# EAGLE design TaaraNodeEthernet (EAGLE 6.1)
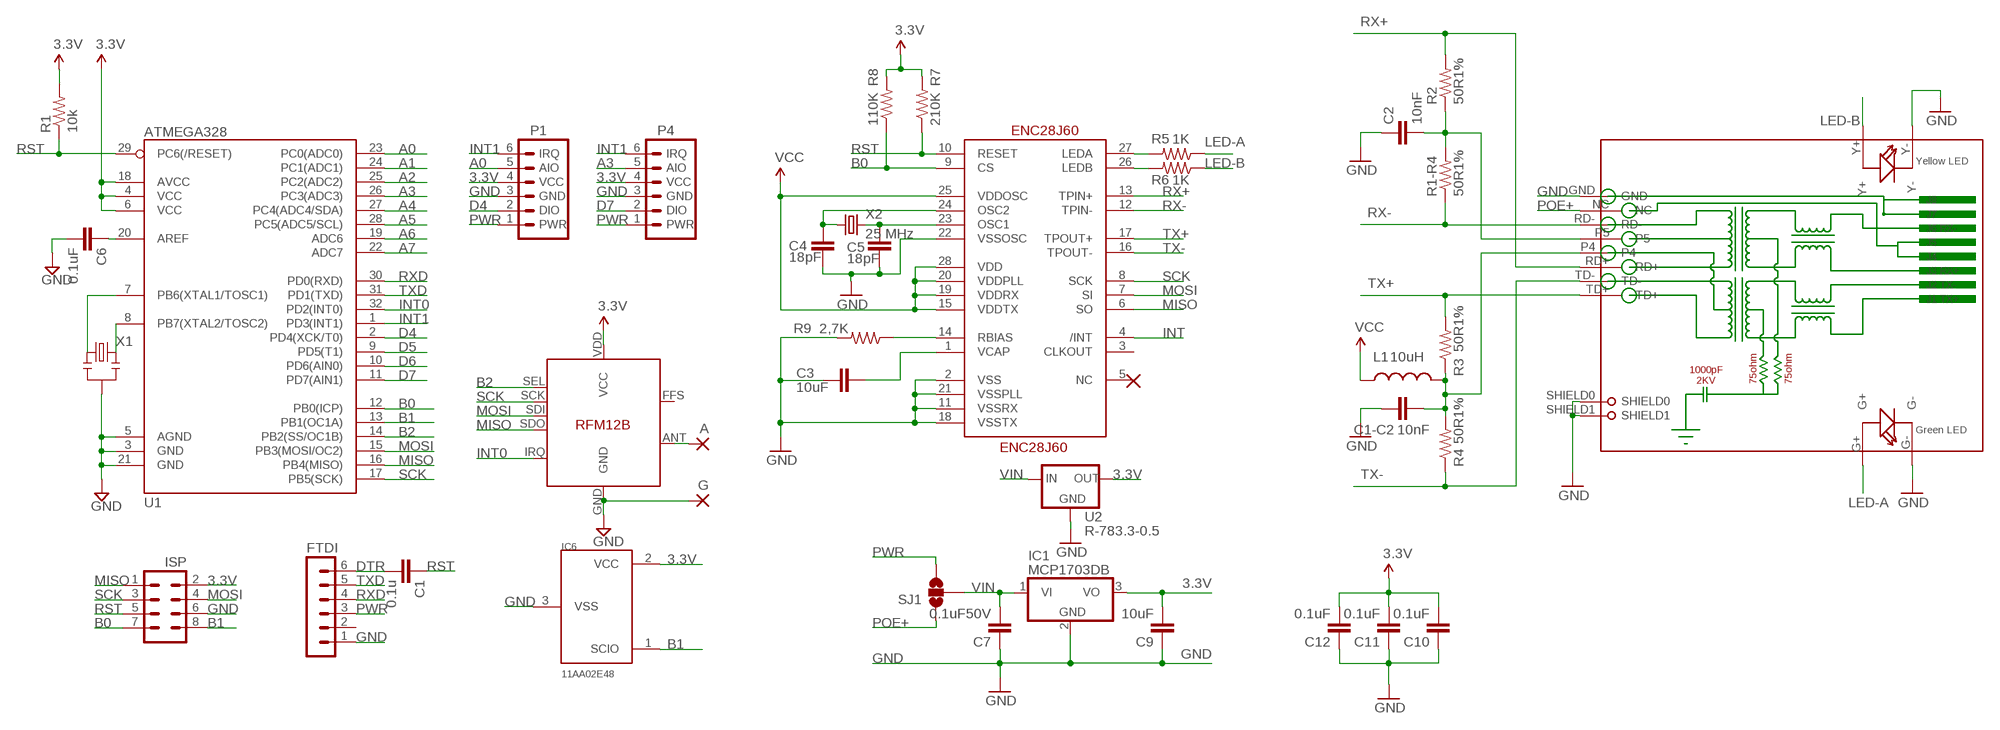
[diagram p0: schematic, sheet 1]

## Parts
A  1,6/0,8  [1,6/0,8]
C1  0.1u  CAP0603-CAP  [0603-CAP]
C1-C2  10nF  CAP0603-CAP  [0603-CAP]
C2  10nF  CAP0603-CAP  [0603-CAP]
C3  10uF  CAP0603-CAP  [0603-CAP]
C4  18pF  CAP0603-CAP  [0603-CAP]
C5  18pF  CAP0603-CAP  [0603-CAP]
C6  0.1uF  CAP0603-CAP  [0603-CAP]
C7  0.1uF50V  CAP0603-CAP  [0603-CAP]
C9  10uF  CAP0603-CAP  [0603-CAP]
C10  0.1uF  CAP0603-CAP  [0603-CAP]
C11  0.1uF  CAP0603-CAP  [0603-CAP]
C12  0.1uF  CAP0603-CAP  [0603-CAP]
ENC28J60  ENC28J60  [SSOP28DB]
FTDI  MA06-1  [MA06-1]
G  1,6/0,8  [1,6/0,8]
IC1  MCP1703DB  [SOT223]
IC6  11AA02E48  [SOT23]
L1  10uH  INDUCTOR0603  [0603]
P1  JEEPORT-FEMALE  [1X06_FEMALE_LOCK.010]
P4  JEEPORT-FEMALE  [1X06_FEMALE_LOCK.010]
R1  10k  RESISTOR0603-RES  [0603-RES]
R1-R4  50R1%  RESISTOR0603-RES  [0603-RES]
R2  50R1%  RESISTOR0603-RES  [0603-RES]
R3  50R1%  RESISTOR0603-RES  [0603-RES]
R4  50R1%  RESISTOR0603-RES  [0603-RES]
R5  1K  RESISTOR0603-RES  [0603-RES]
R6  1K  RESISTOR0603-RES  [0603-RES]
R7  210K  RESISTOR0603-RES  [0603-RES]
R8  110K  RESISTOR0603-RES  [0603-RES]
R9  2,7K  RESISTOR0603-RES  [0603-RES]
RJ1  HLJ-6115ANL  [HR911105A]
SJ1  SOLDERJUMPER_2WAYT  [SJ_2]
SV7  ISP  MA04-2  [MA04-2]
U1  ATMEGA328  ATMEGA168  [TQFP32-08]
U2  R-783.3-0.5  R-78XX  [R-78XX]
U$1  RFM12B  [RFM12B]
X1  RESONATORSMD  [RESONATOR-SMD]
X2  25 MHz  CRYSTAL3.2X2.5  [CRYSTAL-SMD-3.2X2.5]

## Nets
3.3V [power]: C9.2 C10.2 C11.2 C12.2 ENC28J60.15(VDDTX) ENC28J60.19(VDDRX) ENC28J60.20(VDDPLL) ENC28J60.25(VDDOSC) ENC28J60.28(VDD) IC1.3(VO) IC6.2(VCC) L1.1 P1.4(VCC) P4.4(VCC) R1.2 R7.2 R8.2 SV7.2 U1.4(VCC) U1.6(VCC) U1.18(AVCC) U2.OUT U$1.VDD(VCC) ; supply symbol labelled VCC
A0: P1.5(AIO) U1.23(PC0(ADC0))
A1: U1.24(PC1(ADC1))
A2: U1.25(PC2(ADC2))
A3: P4.5(AIO) U1.26(PC3(ADC3))
A4: U1.27(PC4(ADC4/SDA))
A5: U1.28(PC5(ADC5/SCL))
A6: U1.19(ADC6)
A7: U1.22(ADC7)
B0: ENC28J60.9(CS) R8.1 SV7.7 U1.12(PB0(ICP))
B1: IC6.1(SCIO) SV7.8 U1.13(PB1(OC1A))
B2: U1.14(PB2(SS/OC1B)) U$1.SEL
D4: P1.2(DIO) U1.2(PD4(XCK/T0))
D5: U1.9(PD5(T1))
D6: U1.10(PD6(AIN0))
D7: P4.2(DIO) U1.11(PD7(AIN1))
DTR: C1.2 FTDI.6
GND [power]: C1-C2.1 C2.1 C3.1 C4.1 C5.1 C6.2 C7.1 C9.1 C10.1 C11.1 C12.1 ENC28J60.2(VSS) ENC28J60.11(VSSRX) ENC28J60.18(VSSTX) ENC28J60.21(VSSPLL) ENC28J60.22(VSSOSC) FTDI.1 G.1(P) IC1.2(GND) IC6.3(VSS) P1.3(GND) P4.3(GND) R9.2 RJ1.G- RJ1.GND RJ1.SHIELD0 RJ1.SHIELD1 RJ1.Y- SV7.6 U1.3(GND) U1.5(AGND) U1.21(GND) U2.GND U$1.GND X1.2
INT: ENC28J60.4(/INT)
INT0: U1.32(PD2(INT0)) U$1.IRQ
INT1: P1.6(IRQ) P4.6(IRQ) U1.1(PD3(INT1))
LED-A: R5.1 RJ1.G+
LED-B: R6.1 RJ1.Y+
MISO: ENC28J60.6(SO) SV7.1 U1.16(PB4(MISO)) U$1.SDO
MOSI: ENC28J60.7(SI) SV7.4 U1.15(PB3(MOSI/OC2)) U$1.SDI
N$1: U1.7(PB6(XTAL1/TOSC1)) X1.1
N$2: C6.1 U1.20(AREF)
N$9: ENC28J60.27(LEDA) R5.2
N$10: ENC28J60.26(LEDB) R6.2
N$12: ENC28J60.14(RBIAS) R9.1
N$13: C3.2 ENC28J60.1(VCAP)
N$15: C4.2 ENC28J60.24(OSC2) X2.1
N$16: C5.2 ENC28J60.23(OSC1) X2.3
N$18: A.1(P) U$1.ANT
N$21: U1.8(PB7(XTAL2/TOSC2)) X1.3
POE+ [power]: RJ1.NC SJ1.1
PWR [power]: FTDI.3 P1.1(PWR) P4.1(PWR) SJ1.3
RCT: C2.2 R1-R4.2 R2.1 RJ1.P5
RST: C1.1 ENC28J60.10(RESET) R1.1 R7.1 SV7.5 U1.29(PC6(/RESET))
RX+: ENC28J60.13(TPIN+) R2.2 RJ1.RD+
RX-: ENC28J60.12(TPIN-) R1-R4.1 RJ1.RD-
RXD: FTDI.4 U1.30(PD0(RXD))
SCK: ENC28J60.8(SCK) SV7.3 U1.17(PB5(SCK)) U$1.SCK
TCT: C1-C2.2 L1.2 R3.1 R4.2 RJ1.P4
TX+: ENC28J60.17(TPOUT+) R3.2 RJ1.TD+
TX-: ENC28J60.16(TPOUT-) R4.1 RJ1.TD-
TXD: FTDI.5 U1.31(PD1(TXD))
VIN [power]: C7.2 IC1.1(VI) SJ1.2 U2.IN
Unconnected: ENC28J60.3(CLKOUT) ENC28J60.5(NC) FTDI.2 U$1.FFS

## Library data of the parts
A G = wirepad:1,6/0,8: THROUGH-HOLE PAD
C1 C1-C2 C2-C7 C9-C12 = SparkFun:CAP: Capacitor Standard 0603 ceramic capacitor, and 0.1" leaded capacitor.
ENC28J60 = SparkFun:ENC28J60
FTDI = JeeLabs:MA06-1: PIN HEADER
IC1 = linear:MCP1703: 250 mA, 16V, Low Quiescent Current LDO Regulator Source: http://ww1.microchip.com/downloads/en/DeviceDoc/22049b.pdf
IC6 = nanode:11AA02E48
L1 = SparkFun:INDUCTOR: Inductors Basic Inductor/Choke - 0603 and 1206. Footprints are not proven and vary greatly between part numbers.
P1 P4 = JeeLabs:JEEPORT: PIN HEADER
R1 R1-R4 R2-R9 = SparkFun:RESISTOR: Resistor Basic schematic elements and footprints for 0603, 1206, and PTH resistors.
RJ1 = Itead_BP_110825:HLJ-6115ANL: SOC015
SJ1 = SparkFun:SOLDERJUMPER_2WAY: Solder Jumper 2 way solder jumper
SV7 = JeeLabs:MA04-2: PIN HEADER
U1 = SparkFun:ATMEGA168
U2 = omc:R-78XX: Recom R78xx - Switching Regulator - pin-out compatible with LM78xx - up to 97% efficiency - input range 4.75V to 18V for 1A or 34V for 0.5A version, resp. - L * W * H = 11.5mm * 7.5mm * 10.2mm - low ripple and noise (less than 30mVpp) - short circuit protection, thermal shutdown
U$1 = JeeLabs:RFM12B
X1 = SparkFun:RESONATOR: Resonator Small SMD resonator. This is the itty bitty 10/20MHz resonators with built in caps. CSTCE10M0G55 and CSTCE20M0V53. Footprint has been reviewed closely but hasn't been tested yet.
X2 = JeeLabs:CRYSTAL: Crystals Various standard crystals. Proven footprints. Spark Fun Electronics SKU : COM-00534

## Net classes
0 default: width 0.203 mm, clearance 0.203 mm
1 power: width 0.381 mm, clearance 0.254 mm

## Board
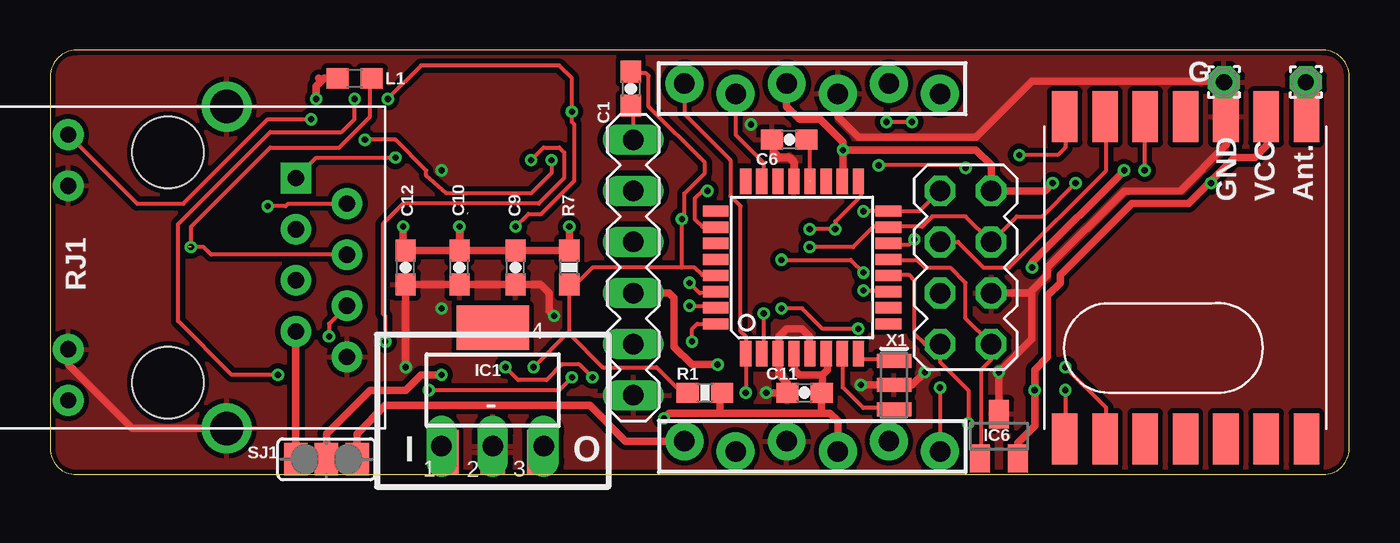
[diagram p1: board, top side]
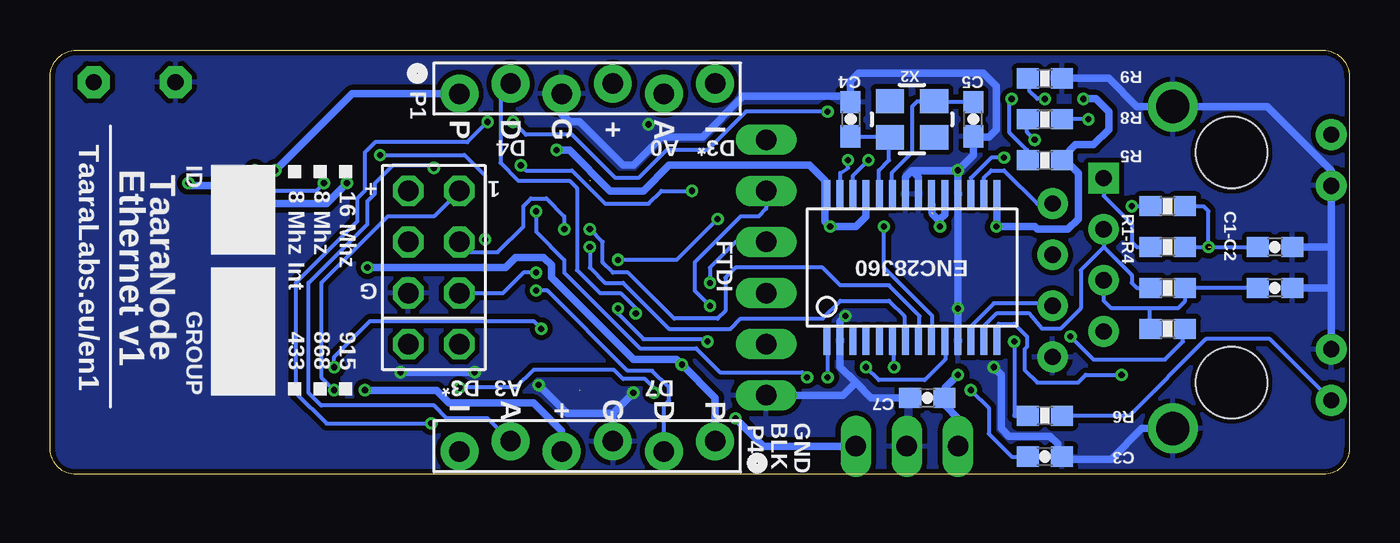
[diagram p2: board, bottom side, seen from below]

Size 64.52 x 21.08 mm. Coordinates in mm from the lower left corner, seen from the top.
Outline: 63.25,0 arc90 64.52,1.27 64.52,19.81 arc90 63.25,21.08 1.27,21.08 arc90 0,19.81 0,1.27 arc90 1.27,0 63.25,0
Copper layers (1*16): Top 0.035mm / dielectric 1.5mm / Bottom 0.035mm
Design rules: minimum track width 6mil, minimum drill 12mil, track to track 6mil, track to pad 6mil, pad to pad 6mil, via to via 6mil, smd to smd 0mil, copper to edge 10mil, drill to drill 10mil, minimum pad ring 10mil, minimum via ring 6mil, stop-mask expansion 2mil, vias tented up to drill 100mil, thermal gap 10mil

### Footprints (pad centres in the part's own frame; a part is rotated, then mirrored left to right if it is on the bottom)
1,6/0,8 = drill 0.813 pad 1.6 octagon: 1 0,0
0603-CAP = smd 1.1 x 1: 1 -0.85,0; 2 0.85,0
SSOP28DB = smd 0.348 x 1.397: 1 -4.225,-3.656; 2 -3.575,-3.656; 3 -2.925,-3.656; 4 -2.275,-3.656; 5 -1.625,-3.656; 6 -0.975,-3.656; 7 -0.325,-3.656; 8 0.325,-3.656; 9 0.975,-3.656; 10 1.625,-3.656; 11 2.275,-3.656; 12 2.925,-3.656; 13 3.575,-3.656; 14 4.225,-3.656; 15 4.225,3.656; 16 3.575,3.656; 17 2.925,3.656; 18 2.275,3.656; 19 1.625,3.656; 20 0.975,3.656; 21 0.325,3.656; 22 -0.325,3.656; 23 -0.975,3.656; 24 -1.625,3.656; 25 -2.275,3.656; 26 -2.925,3.656; 27 -3.575,3.656; 28 -4.225,3.656
MA06-1 = drill 1.016 long: 1 0,0; 2 2.54,0; 3 5.08,0; 4 7.62,0; 5 10.16,0; 6 12.7,0
SOT223 = smd 1.219 x 2.235: 1 -2.311,-3.099; 2 0,-3.099; 3 2.311,-3.099 | smd 3.6 x 2.2: 4 0,3.099
SOT23 = smd 1 x 1.4: 1 -0.95,-1.1; 2 0.95,-1.1; 3 0,1.1
0603 = smd 1.1 x 1: 1 -0.85,0; 2 0.85,0
1X06_FEMALE_LOCK.010 = drill 1.016 pad 1.88: 1 0,0.254; 2 2.54,-0.254; 3 5.08,0.254; 4 7.62,-0.254; 5 10.16,0.254; 6 12.7,-0.254
0603-RES = smd 1.1 x 1: 1 -0.85,0; 2 0.85,0
HR911105A = drill 0.813 pad 1.524: G+ 4.953,-6.604; G- 4.953,-4.064; GND -8.89,4.445; NC -6.35,3.175; P4 -8.89,-0.635; P5 -6.35,0.635; RD+ -6.35,-1.905; RD- -8.89,1.905; TD- -8.89,-3.175; Y+ 4.953,6.604; Y- 4.953,4.064 | drill 1.651 pad 2.159: SHIELD0 -2.921,8.001; SHIELD1 -2.921,-8.001 | drill 0.813 pad 1.524 square: TD+ -6.35,-4.445 | hole 3.556: 0,-5.715; 0,5.715
SJ_2 = smd 1.168 x 1.6: 1 -1.524,0; 2 0,0; 3 1.524,0
MA04-2 = drill 1.016 octagon: 1 -3.81,-1.27; 2 -3.81,1.27; 3 -1.27,-1.27; 4 -1.27,1.27; 5 1.27,-1.27; 6 1.27,1.27; 7 3.81,-1.27; 8 3.81,1.27
TQFP32-08 = smd 1.27 x 0.559: 1 -4.293,2.8; 2 -4.293,2; 3 -4.293,1.2; 4 -4.293,0.4; 5 -4.293,-0.4; 6 -4.293,-1.2; 7 -4.293,-2; 8 -4.293,-2.8; 17 4.293,-2.8; 18 4.293,-2; 19 4.293,-1.2; 20 4.293,-0.4; 21 4.293,0.4; 22 4.293,1.2; 23 4.293,2; 24 4.293,2.8 | smd 0.559 x 1.27: 9 -2.8,-4.293; 10 -2,-4.293; 11 -1.2,-4.293; 12 -0.4,-4.293; 13 0.4,-4.293; 14 1.2,-4.293; 15 2,-4.293; 16 2.8,-4.293; 25 2.8,4.293; 26 2,4.293; 27 1.2,4.293; 28 0.4,4.293; 29 -0.4,4.293; 30 -1.2,4.293; 31 -2,4.293; 32 -2.8,4.293
R-78XX = drill 1.016 long: GND 0,-1.775; IN -2.54,-1.775; OUT 2.54,-1.775
RFM12B = smd 2.54 x 1.27: ANT 8,-6; FFS -8,2; GND 8,-2; IRQ -8,4; P$8 -8,0; P$9 -8,-2; P$10 -8,-4; P$12 -8,-6; P$16 8,0; SCK 8,4; SDI 8,2; SDO -8,6; SEL 8,6; VDD 8,-4
RESONATOR-SMD = smd 0.7 x 1.7: 1 -1.2,0; 2 0,0; 3 1.2,0
CRYSTAL-SMD-3.2X2.5 = smd 1.4 x 1.2: 1 -1.1,-0.9; 2 1.1,-0.9; 3 1.1,0.9; 4 -1.1,0.9

### Placement (x,y rotation side)
A  62.36,19.5 0 top
C1  28.83,19.18 270 top
C1-C2  3.68,11.3 180 bottom
C2  3.68,9.27 180 bottom
C3  15.11,0.89 180 bottom
C4  24.77,17.65 270 bottom
C5  18.67,17.65 90 bottom
C6  36.7,16.64 180 top
C7  20.96,3.81 0 bottom
C9  23.11,10.29 90 top
C10  20.32,10.29 90 top
C11  37.47,4.06 0 top
C12  17.65,10.29 90 top
ENC28J60  21.72,10.29 0 bottom
FTDI  28.96,3.94 90 top
G  58.3,19.5 0 top
IC1  21.97,4.19 0 top
IC6  47.12,1.91 0 top
L1  15.11,19.68 0 top
P1  44.2,19.18 180 top
P4  31.5,1.4 0 top
R1  32.51,4.06 0 top
R1-R4  9.02,7.24 180 bottom
R2  9.02,9.27 180 bottom
R3  9.02,11.3 180 bottom
R4  9.02,13.33 0 bottom
R5  15.11,17.65 180 bottom
R6  15.11,2.92 180 bottom
R7  25.78,10.29 90 top
R8  15.11,15.62 0 bottom
R9  15.11,19.68 0 bottom
RJ1  5.84,10.29 180 top
SJ1  13.72,0.76 0 top
SV7  45.47,10.29 270 top
U1  37.34,10.29 90 top
U2  21.97,3.17 0 top
U$1  56.39,9.78 90 top
U$2  [NODEPARAMS]  48.9,10.29 0 top
X1  41.91,4.45 90 top
X2  21.72,17.65 0 bottom

### Tracks (layer width: path | path; a pad name or v marks a point on that pad's centre or on a via)
3.3V  (via drill 0.3)  (2 unrouted)
  Top 0.381: 25.78,10.79 R7.2 | v17.53,12.32 17.53,10.79 C12.2 C10.2 | U1.18 39.37,14.6 v39.37,16.13 | v39.37,16.13 45.97,16.13 46.74,15.37 SV7.2 49.4,14.1 v49.78,14.48 | U1.4 36.96,5.84 36.96,5.21 37.21,4.95 38.35,4.95 | U1.6 38.61,5.84 38.61,5.21 38.35,4.95 | 33.27,4.06 R1.2 33.27,4.06 | 57.59,14.54 56.52,13.46 53.72,13.46 50.17,9.91 50.17,9.52 49.53,8.89 49.53,5.84 48.9,5.21 v48.9,4.19 48.9,2.41 48.07,1.59 IC6.2 48.13,0.74 | 57.59,14.54 58.8,15.75 59.82,15.75 60.45,16.38 60.45,17.65 U$1.VDD | v30.48,2.79 30.73,3.05 33.27,3.05 | 33.27,4.06 33.27,3.05 | 33.02,4.06 33.27,4.06 | v57.66,14.48 57.59,14.54 | L1.1 13.59,19.68 13.46,19.56 | 13.46,19.56 13.21,19.3 v13.21,18.67 | P4.4 39.12,2.67 38.73,3.05 38.31,3.05 | 38.31,3.05 33.27,3.05 | IC1.3 24.52,1.06 | R7.2 C9.2 20.47,11.14 | P1.4 36.58,18.29 37.21,17.65 38.23,17.65 39.37,16.51 v39.37,16.13 | 13.34,19.68 13.46,19.56 | 38.2,4.18 C11.2 38.31,3.05 | R7.2 v25.78,12.32 | 38.35,4.95 38.35,4.32 38.23,4.19
  Top 0.406: U2.OUT 24.51,1.32 IC1.3 | v20.32,12.32 20.32,11.16 | 20.32,11.16 C10.2 | 20.32,11.16 20.47,11.14
  Bottom 0.381: v13.21,18.67 12.57,18.67 11.94,18.03 11.94,17.14 12.7,16.38 13.59,16.38 14.22,15.75 | 14.22,15.75 R8.2 | ENC28J60.25 24,13.72 24,12.83 24.51,12.32 v25.78,12.32 26.04,12.57 26.04,13.72 | 26.04,13.72 ENC28J60.28 | 14.22,15.75 13.46,14.99 13.46,12.7 13.97,12.19 15.49,12.19 15.62,12.32 v17.53,12.32 17.49,12.48 ENC28J60.15 | v48.9,4.19 45.34,4.19 44.7,3.56 40.52,3.56 39.12,2.16 P4.4 | v49.78,14.48 50.8,13.46 53.59,13.46 54.48,14.35 57.53,14.35 v57.66,14.48 | 26.04,13.72 26.04,14.6 26.8,15.37 33.78,15.37 35.05,14.1 36.7,14.1 38.73,16.13 v39.37,16.13 | ENC28J60.20 20.71,13.02 | ENC28J60.19 20.09,13.01 20.09,12.93 20.32,12.7 | U2.OUT 29.09,1.4 v30.48,2.79 | 20.32,12.7 20.45,12.7 20.7,12.95 | v20.32,12.32 20.32,12.7
A0
  Top 0.203: U1.23 35.43,14.6 35.43,15.49 34.04,16.89 P1.5
A2
  Top 0.203: U1.25 33.27,13.08 33.3,13.11
A3  (via drill 0.3)
  Top 0.203: v32.64,14.1 32.39,14.1 32,13.72 32,12.7 32.39,12.32 33.02,12.32 U1.26 | v41.15,15.37 45.34,15.37 v45.47,15.24
  Bottom 0.203: v32.64,14.1 34.16,14.1 34.8,13.46 36.96,13.46 38.61,15.11 40.89,15.11 v41.15,15.37 | v45.47,15.24 45.59,15.37 47.5,15.37 48.39,14.48 48.39,13.97 48.77,13.59 48.77,12.45 51.69,9.52 51.69,4.06 51.05,3.43 45.47,3.43 44.83,2.79 42.8,2.79 P4.5
B0  (via drill 0.3)
  Top 0.203: U1.12 41.78,9.91 42.67,9.91 42.93,9.65 42.93,6.99 43.43,6.48 SV7.7 44.2,5.59 45.59,4.19 v45.59,2.54 | v16.76,18.67 18.42,20.32 25.27,20.32 25.91,19.68 v25.91,18.03 25.91,17.53 26.04,17.4 26.04,14.6 24.38,12.95 23.75,12.95 v23.11,12.32 | v41.53,17.53 v42.8,17.53
  Bottom 0.203: v16.76,18.67 16.89,18.54 16.89,17.02 16,16.13 16,15.75 R8.1 | v23.11,12.32 23.11,10.29 20.7,7.87 20.7,6.48 ENC28J60.9 | v45.59,2.54 50.8,2.54 52.32,4.06 52.32,9.52 49.28,12.57 49.28,13.72 48.9,14.1 48.9,16 48.39,16.51 43.81,16.51 v42.8,17.53 | v41.53,17.53 40.89,16.89 38.61,16.89 36.45,14.73 35.31,14.73 33.91,16.13 31.88,16.13 29.97,18.03 v25.91,18.03
B1
  Top 0.203: 41.66,10.67 U1.13 41.78,10.67 43.05,10.67 43.43,10.29 44.7,10.29 45.47,9.52 45.47,7.75 SV7.8 46.74,5.71 46.23,5.21 46.23,1.4 IC6.1
B2  (via drill 0.3)
  Top 0.203: v48.13,15.88 50.04,15.88 50.42,16.26 50.42,17.65 U$1.SEL | U1.14 41.78,11.43 42.67,11.43 v42.93,11.68
  Bottom 0.203: v42.93,11.68 42.93,14.86 43.94,15.88 v48.13,15.88
D4  (via drill 0.3)
  Top 0.203: v35.43,8 35.43,5.97 U1.2
  Bottom 0.203: v35.43,8 35.43,8.25 36.2,9.02 37.21,9.02 38.35,10.16 38.35,14.22 38.73,14.6 41.28,14.6 42.16,15.49 42.16,18.92 P1.2
D7  (via drill 0.3)
  Top 0.203: U1.11 41.66,9.02 41.53,9.14 v40.39,9.14
  Bottom 0.203: v40.39,9.14 39.83,9.14 35.84,5.16 34.62,5.16 33.78,4.32 33.78,3.68 34.04,3.43 P4.2
DTR
  Top 0.203: FTDI.6 28.96,18.16 28.83,18.29 C1.2
GND  (via drill 0.3)
  Top 0.381: U1.5 37.72,5.97 37.72,6.86 37.34,7.24 36.58,7.24 36.2,6.86 36.2,6.22 U1.3 36.2,5.94 36.2,4.95 36.61,4.53 C11.1 v35.56,4.06 | v40.26,4.45 X1.2 42.8,4.45 v43.43,5.08 | 48.77,9.02 48.77,6.73 v47.12,5.08 47.12,3.05 | 48.77,9.02 48.77,9.14 49.53,9.91 49.53,10.29 53.34,14.1 56.13,14.1 58.42,16.38 58.42,17.65 U$1.GND 58.42,17.78 58.29,17.78 G.1 58.29,19.56 48.77,19.56 45.97,16.76 40.13,16.76 39.12,17.78 P1.3 | RJ1.SHIELD0 4.06,2.29 0.89,5.46 RJ1.Y- | 36.96,14.6 U1.21 | C12.1 17.65,9.4 | 17.65,9.4 v17.65,5.33 | v25.02,7.87 24.77,8.13 24.77,9.02 24.35,9.44 C9.1 | IC1.2 22.08,1.13 | 17.65,9.4 17.69,9.44 C10.1 23.24,9.44 | SV7.6 48.77,9.02
  Top 0.406: 23.24,9.44 23.24,9.4 | 36.96,14.6 36.96,15.49 36.7,15.75 36.2,15.75 35.94,16 35.94,16.64
  Bottom 0.381: v40.26,4.45 38.86,3.05 36.58,3.05 | v47.12,5.08 v43.43,5.08 | R9.2 11.94,19.68 10.54,18.29 RJ1.SHIELD1 4.06,18.29 0.89,15.11 RJ1.G- 0.89,11.3 | 0.89,11.3 C1-C2.1 | 0.89,9.27 0.89,11.3 | C2.1 0.89,9.27 | RJ1.Y- 0.89,9.27 | v19.43,8.25 19.43,7.49 | 24.51,4.57 23.75,3.81 C7.1 | 24.51,4.57 25.29,5.35 ENC28J60.2 25.29,7.6 v25.02,7.87 | 18.67,16.76 18.67,15.88 v19.43,15.11 | 18.67,16.76 C5.1 18.67,16.89 | v19.43,15.11 19.43,13.84 ENC28J60.18 19.43,13.59 v19.43,8.25 | C4.1 24.77,19.56 24.38,19.94 18.16,19.94 17.53,19.3 17.53,17.14 17.91,16.76 18.67,16.76 | 24.77,18.41 C4.1 | v19.43,15.11 21.72,15.11 | C4.1 25.02,18.8 30.1,18.8 32.13,16.76 34.16,16.76 35.56,15.37 36.07,15.37 38.23,17.53 38.73,17.53 39.12,17.91 P1.3 | v17.65,5.33 17.27,4.95 17.27,2.29 16.89,1.91 14.86,1.91 14.48,1.52 14.48,0.76 C3.1 14.22,0.76 11.81,0.76 10.29,2.29 RJ1.SHIELD0 | ENC28J60.22 22.04,14.79 21.72,15.11 | ENC28J60.21 21.39,14.79 21.72,15.11 | ENC28J60.11 19.44,7.61 v19.43,8.25 | FTDI.1 25.15,3.94 24.51,4.57 | v35.56,4.06 36.58,3.05 | 36.58,3.05 P4.3
  other vias: 34.8,17.4
  pour Bottom: 1.27,0 63.25,0 arc90 64.52,1.27 64.52,19.81 arc90 63.25,21.08 1.27,21.08 arc90 0,19.81 0,1.27 arc90
  pour Top: 1.27,0 63.25,0 arc90 64.52,1.27 64.52,19.81 arc90 63.25,21.08 1.27,21.08 arc90 0,19.81 0,1.27 arc90
INT0  (via drill 0.3)
  Top 0.203: v31.88,6.6 31.88,7.24 32.13,7.49 33.02,7.49 U1.32 | v36.32,8.25 37.34,8.25 38.35,7.24 v40.13,7.24 | v50.42,5.33 52.45,3.3 52.45,1.78 U$1.IRQ
  Bottom 0.203: v31.88,6.6 32,6.73 35.05,6.73 36.32,8 v36.32,8.25 | v40.13,7.24 40.51,7.62 48.64,7.62 50.42,5.84 v50.42,5.33
INT1  (via drill 0.3)
  Top 0.203: v44.2,4.32 P4.6 | 34.54,5.97 v34.54,4.06 | 34.54,5.97 U1.1 | P1.6 31.5,17.91 33.78,15.62 33.78,13.84 34.29,13.33 34.29,7.11 34.54,6.86 34.54,5.97
  Bottom 0.203: v44.2,4.32 41.4,4.32 40.51,5.21 36.53,5.21 36.07,4.75 34.98,4.75 34.54,4.32 v34.54,4.06
LED-A  (via drill 0.3)
  Top 0.203: v12.95,17.65 10.8,17.65 6.6,13.46 4.32,13.46 RJ1.G+
  Bottom 0.203: v12.95,17.65 R5.1
LED-B
  Bottom 0.203: RJ1.Y+ 3.94,6.73 7.11,6.73 10.92,2.92 R6.1 14.35,2.92
MISO  (via drill 0.3)
  Top 0.203: v22.61,5.33 23.24,4.7 24.64,4.7 25.4,5.46 26.29,5.46 v26.92,4.83 | v40.39,13.08 41.66,13.08 U1.16 41.78,13.08 43.18,13.08 SV7.1 | v50.42,4.19 50.42,1.78 U$1.SDO
  Bottom 0.203: v26.92,4.83 27.18,5.08 31.24,5.08 32.44,6.27 35.23,6.27 38.99,10.03 38.99,10.67 40.39,12.06 v40.39,13.08 | ENC28J60.6 22.61,6.35 v22.61,5.33 | v50.42,4.19 51.05,4.83 51.05,9.52 47.75,12.83 45.47,12.83 SV7.1
MOSI  (via drill 0.3)
  Top 0.203: v37.72,11.3 39.88,11.3 40.89,12.32 41.66,12.32 U1.15 41.78,12.32 43.31,12.32 43.81,12.83 45.47,12.83 SV7.4 48.01,12.83 49.28,12.83 v50.93,14.48 | v54.36,15.11 54.36,17.65 U$1.SDI
  Bottom 0.203: v37.72,11.3 37.72,10.29 36.96,9.52 36.07,9.52 33.78,7.24 30.73,7.24 30.23,7.75 26.16,7.75 25.27,8.64 22.86,8.64 22.1,7.87 22.1,6.48 ENC28J60.7 | v54.36,15.11 53.34,14.1 51.31,14.1 v50.93,14.48
N$1
  Top 0.203: U1.7 39.37,5.84 39.37,4.32 40.39,3.3 41.91,3.3 X1.1
N$2  (1 unrouted)
  Top 0.203: C6.1 37.72,16.47 37.72,14.6
N$9  (via drill 0.3)
  Top 0.203: v15.62,16.64 17.14,16.64 18.67,15.11 18.67,14.86 19.68,13.97 23.88,13.97 24.89,14.99 v24.89,15.62
  Bottom 0.203: v15.62,16.64 16,17.02 16,17.65 R5.2 | v24.89,15.62 24.89,15.24 25.27,14.99 25.27,13.84 ENC28J60.27
N$10  (via drill 0.3)
  Top 0.203: v16.64,6.6 16.64,7.87 16.51,8 16.51,12.45 17.53,13.46 24.26,13.46 25.53,14.73 25.53,16 25.27,16.26 24.51,16.26 v23.88,15.62
  Bottom 0.203: R6.2 16.64,2.92 v16.64,6.6 | v23.88,15.62 24.64,14.86 24.64,13.84 ENC28J60.26
N$12  (via drill 0.3)
  Top 0.203: v15.11,18.67 15.11,17.65 14.48,17.02 10.92,17.02 6.35,12.45 6.35,7.62 9.02,4.95 v11.3,4.95
  Bottom 0.203: v15.11,18.67 15.49,18.67 15.88,19.05 15.88,19.68 R9.1 | v11.3,4.95 13.08,4.95 13.46,4.57 15.49,4.57 16.13,5.21 16.13,6.22 16,6.35 16,6.86 16.64,7.49 17.4,7.49 17.53,7.37 17.53,6.48 ENC28J60.14
N$13  (via drill 0.3)
  Top 0.203: v18.8,4.19 25.27,4.19 v25.91,4.83
  Bottom 0.203: C3.2 16.76,0.89 17.91,2.03 17.91,3.3 v18.8,4.19 | ENC28J60.1 25.91,6.35 v25.91,4.83
N$15
  Bottom 0.203: 22.99,16.64 X2.1 | ENC28J60.24 23.37,13.84 23.37,15.11 22.86,15.62 22.86,16.76 22.9,16.8 | 22.86,16.71 X2.1 | C4.2 22.9,16.8 | 22.9,16.8 22.87,16.8 X2.1
N$16
  Bottom 0.203: C5.2 18.67,18.54 20.45,18.54 X2.3 20.7,18.54 21.46,18.54 21.72,18.29 21.72,16 22.73,14.99 22.73,13.97 ENC28J60.23
N$18
  Top 0.203: U$1.ANT 62.36,17.78 62.36,19.43 A.1
N$21
  Top 0.203: U1.8 40.26,5.84 40.39,5.71 41.91,5.71 X1.3
POE+
  Top 0.381: RJ1.NC SJ1.1
PWR  (via drill 0.3)
  Top 0.381: 13.72,0.76 SJ1.3 15.24,2.03 16.64,3.43 26.8,3.43 28.57,1.65 P4.1 | v53.34,15.11 48.77,10.54 v48.77,10.29 | v33.15,5.46 31.88,5.46 30.99,6.35 30.99,8.76 30.73,9.02 FTDI.3
  Bottom 0.381: v53.34,15.11 49.53,18.92 P1.1 | v48.77,10.29 41.91,10.29 41.4,10.79 40,10.79 39.62,10.41 39.62,9.78 35.56,5.71 33.4,5.71 v33.15,5.46 31.5,3.81 P4.1
RCT
  Bottom 0.203: C2.2 R2.1 8.17,8.6 8.51,8.25 9.91,8.25 | 9.78,7.37 R1-R4.2 9.91,7.37 9.91,8.25 | 9.91,8.25 11.81,8.25 12.19,8.64 RJ1.P5
RST  (via drill 0.3)
  Top 0.203: R7.1 25.78,7.11 25.72,7.05 | v24,5.33 25.72,7.05 | 25.72,7.05 27.43,5.33 30.1,5.33 31.37,4.06 31.5,4.06 R1.1 | 33.15,9.91 U1.29 33.02,9.91 32.39,9.91 32,10.29 31.37,10.29 | v40.39,10.03 39.75,10.67 v36.32,10.67 | 31.37,10.29 26.92,10.29 26.16,9.52 25.78,9.52 R7.1 | 25.91,9.14 R7.1 | C1.1 28.92,19.94 29.59,19.94 29.72,19.81 29.72,18.29 32.51,15.49 32.51,14.99 31.5,13.97 31.5,12.83 v31.37,12.7 31.37,10.29
  Bottom 0.203: v24,5.33 23.37,4.7 21.08,4.7 20.07,5.71 20.07,6.35 ENC28J60.10 | v31.37,12.7 33.4,10.67 v36.32,10.67 | v40.39,10.03 41.02,10.03 42.04,9.02 SV7.5
RX+
  Bottom 0.203: 12.19,11.3 10.8,9.91 10.8,9.52 10.54,9.27 R2.2 9.78,9.27 | 12.19,11.3 RJ1.RD+ 12.19,12.32 | 12.19,11.3 13.34,10.16 13.34,8.25 14.35,7.24 15.24,7.24 15.88,8 17.53,8 18.16,7.37 18.16,6.48 ENC28J60.13
RX-  (via drill 0.3)
  Top 0.203: v13.84,6.86 13.84,7.49 RJ1.RD-
  Bottom 0.203: v13.84,6.86 12.7,5.71 9.14,5.71 8.25,6.6 8.25,7.37 R1-R4.1 | ENC28J60.12 18.8,6.48 18.8,7.37 17.65,8.51 14.86,8.51 RJ1.RD-
RXD  (via drill 0.3)
  Top 0.203: U1.30 33.02,9.02 32.26,9.02 v31.75,9.52
  Bottom 0.203: v31.75,9.52 31.75,10.29 30.48,11.56 FTDI.4
SCK  (via drill 0.3)
  Top 0.203: U1.17 40.26,14.48 40.26,13.84 38.99,12.57 v38.99,12.19 v37.72,12.19 | U$1.SCK 52.45,17.65 52.45,15.11 47.62,10.29 46.36,10.29 45.08,11.56 SV7.3
  Bottom 0.203: v37.72,12.19 37.08,11.56 37.08,10.54 36.58,10.03 35.81,10.03 33.53,7.75 31.37,7.75 30.99,8.13 30.99,9.78 30.48,10.29 26.16,10.29 25.27,9.4 22.86,9.4 21.34,7.87 21.34,6.48 ENC28J60.8 | v38.99,12.19 38.99,12.83 39.88,13.72 40.64,13.72 41.02,13.33 41.02,12.32 42.29,11.05 43.69,11.05 SV7.3
TCT  (via drill 0.3)  (1 unrouted)
  Top 0.203: L1.2 15.88,19.68 15.88,17.78 14.35,16.26 10.92,16.26 6.98,12.32 v6.98,11.3 | RJ1.P4 8,10.92 7.62,11.3 6.86,11.3
  Bottom 0.203: R3.1 v6.98,11.3 | v6.98,11.3 C1-C2.2 | v6.98,11.3 6.98,13.08 7.24,13.33 R4.2
TX+  (via drill 0.3)
  Top 0.203: v17.14,15.75 13.21,15.75 RJ1.TD+
  Bottom 0.203: R3.2 10.54,11.3 10.8,11.56 10.8,12.45 12.19,13.84 RJ1.TD+ | v17.14,15.75 17.78,15.75 18.8,14.73 18.8,13.84 ENC28J60.17
TX-  (via drill 0.3)
  Top 0.203: v10.8,13.33 11.68,13.33 11.81,13.46 RJ1.TD-
  Bottom 0.203: v10.8,13.33 R4.1 | ENC28J60.16 18.16,13.84 18.16,14.73 17.78,15.11 17.14,15.11 15.49,13.46 RJ1.TD- 14.61,13.46
TXD  (via drill 0.3)
  Top 0.203: v31.75,8.38 33.02,8.38 U1.31
  Bottom 0.203: v31.75,8.38 32.51,9.14 32.51,10.54 30.23,12.83 29.34,12.83 28.96,13.21 FTDI.5
VIN  (via drill 0.3)
  Top 0.381: SJ1.2 13.72,2.03 15.88,4.19 17.65,4.19 18.42,4.95 v19.43,4.95 | IC1.1 19.62,1.06
  Top 0.406: U2.IN 19.43,1.32 IC1.1
  Bottom 0.381: 20.07,3.81 C7.2 20.07,3.43 | v19.43,4.95 20.07,4.32 20.07,3.81 | 20.07,3.81 20.07,3.43 | 20.07,3.43 19.43,2.79 U2.IN

### Text on the board
_tsilk: A | I | A | + | G | D | P | D3* | A0 | D4 | 1 | + | RFM12B | FTDI | ATMEGA328 | G | D7 | A3 | D3* | P | D | G | + | A | I | POE | PWR | GND | BLK
_bsilk: P1 | D3* | I | A0 | A | + | G | D4 | D | P | 1 | + | FTDI | G | TaaraNode | Ethernet v1 | TaaraLabs.eu/en1 | D7 | A3 | D3* | GND | BLK | P4 | P | D | G | + | A | I